# Altium schematic sheet JBC_245.SchDoc
size A4; SheetNumber: 1; SheetTotal: 1
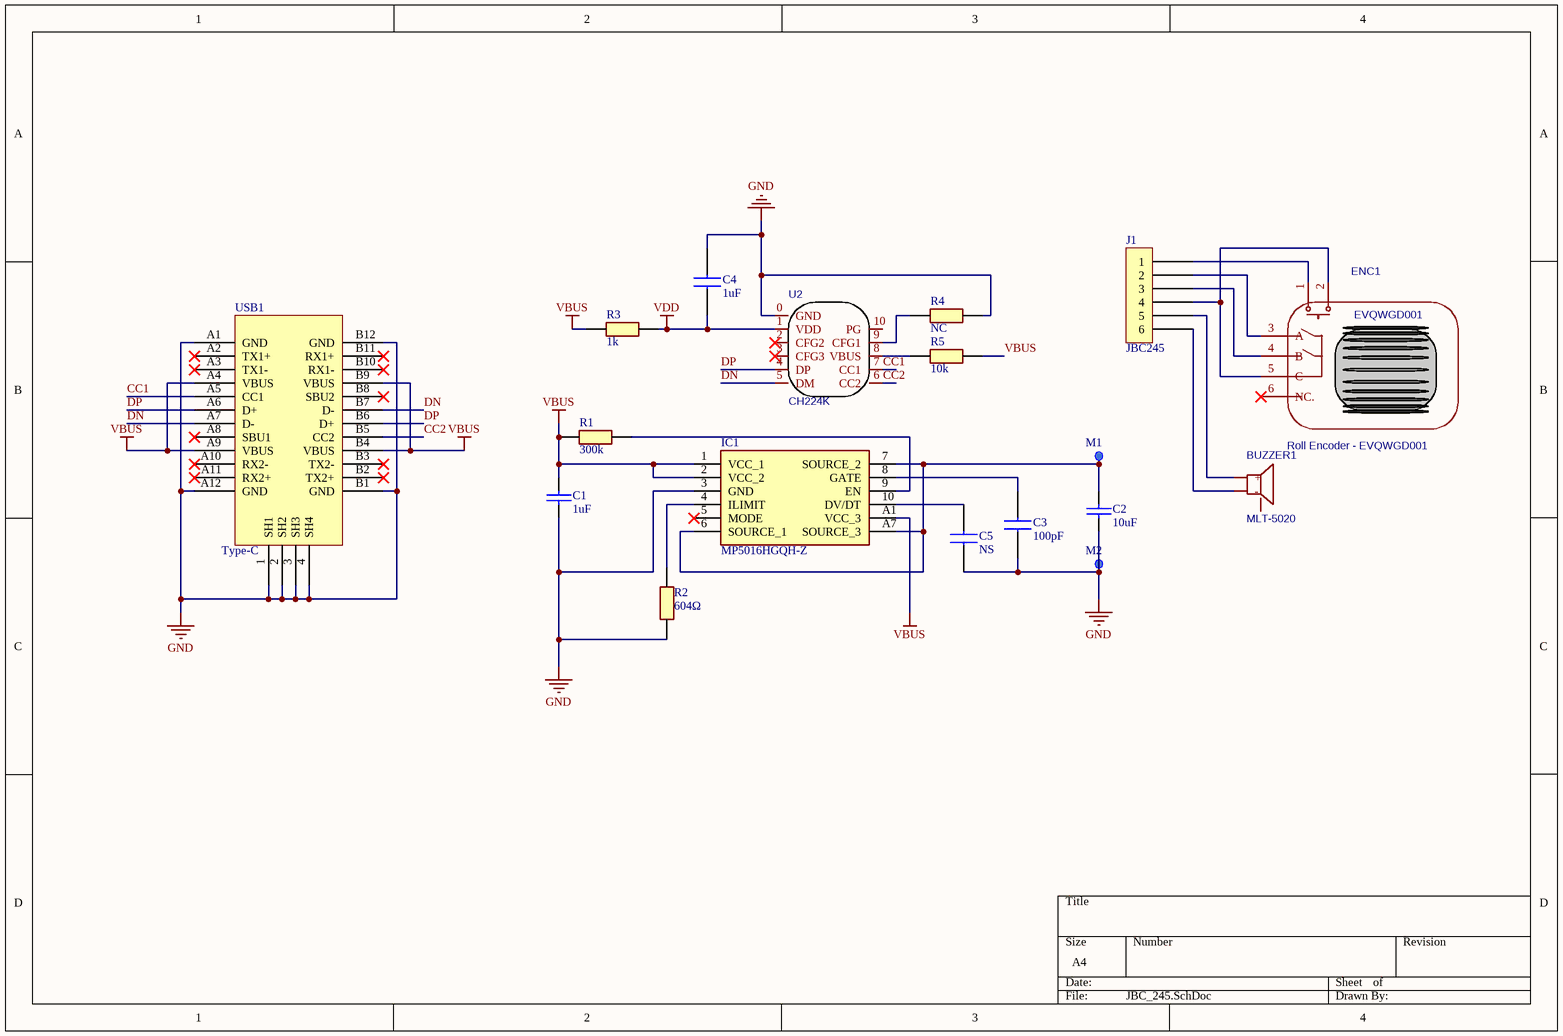
[diagram p0: JBC_245.SchDoc]

## Parts
BUZZER1  MLT-5020  [BUZ-SMD_3P-L5.2-W5.2-P3.50-BR]
C1  1uF  [1206C]
C2  10uF  [1206C]
C3  100pF  [CAP_0402]
C4  1uF  [CAP_0402]
C5  NS  [CAP_0402]
IC1  MP5016HGQH-Z  [MP5016HGQHZ]
J1  JBC245  [JBC_245_Connect]
M1  Test_Point  [TP-PIN]  (value not drawn)
M2  Test_Point  [TP-PIN]  (value not drawn)
R1  300k  [RES_0402]
R2  604Ω  [RES_0402]
R3  1k  [RES_0402]
R4  NC  [RES_0402]
R5  10k  [RES_0402]
U1  Roll Encoder - EVQWGD001  [EVQWGD001 ENCODER]
U2  CH224K  [ESSOP-10_L5.0-W3.9]
USB1  Type-C  [Type-C-TOP]

## Nets
GND: C1.1 C2.1 C3.1 C4.2 C5.1 IC1.3(GND) M2.1 R2.1 R4.2 U2.0(GND) USB1.1(SH1) USB1.2(SH2) USB1.3(SH3) USB1.4(SH4) USB1.A1(GND) USB1.A12(GND) USB1.B1(GND) USB1.B12(GND)
VBUS: C1.2 IC1.1(VCC_1) IC1.2(VCC_2) IC1.A1(VCC_3) R1.1 R3.1 R5.2 USB1.A4(VBUS) USB1.A9(VBUS) USB1.B4(VBUS) USB1.B9(VBUS)
VDD: C4.1 R3.2 U2.1(VDD)
CC1: U2.7(CC1) USB1.A5(CC1)
CC2: U2.6(CC2) USB1.B5(CC2)
DN: U2.5(DM) USB1.A7(D-) USB1.B7(D-)
DP: U2.4(DP) USB1.A6(D+) USB1.B6(D+)
NetBUZZER1_2: BUZZER1.2(+) J1.5
NetBUZZER1_3: BUZZER1.3(-) J1.6
NetC2_2: C2.2 IC1.6(SOURCE_1) IC1.7(SOURCE_2) IC1.A7(SOURCE_3) M1.1
NetC3_2: C3.2 IC1.8(GATE)
NetC5_2: C5.2 IC1.10(DV/DT)
NetIC1_4: IC1.4(ILIMIT) R2.2
NetIC1_9: IC1.9(EN) R1.2
NetJ1_1: J1.1 U1.1(SW1)
NetJ1_2: J1.2 U1.3(A)
NetJ1_3: J1.3 U1.4(B)
NetJ1_4: J1.4 U1.2(SW2) U1.5(C)
NetR4_1: R4.1 U2.9(CFG1)
NetR5_1: R5.1 U2.8(VBUS)

Not connected (* = marked no-connect by the designer): BUZZER1 1(NC); IC1 5(MODE)*; U1 6(NC.)*; U2 2(CFG2)* 3(CFG3)* 10(PG); USB1 A2(TX1+)* A3(TX1-)* A8(SBU1)* A10(RX2-)* A11(RX2+)* B2(TX2+)* B3(TX2-)* B8(SBU2)* B10(RX1-)* B11(RX1+)*

## Notes on the sheet
- (in symbol Roll Encoder - EVQWGD001) ENC1

## Library data of the parts
BUZZER1 = MLT-5020: Buzzer; BOM_Manufacturer: HNDZ; BOM_Supplier: LCSC; BOM_Manufacturer Part: MLT-5020; BOM_Supplier Part: C94598; BOM_JLCPCB Part Class: Extended Part; spicePre: B; spiceSymbolName: MLT-5020
C1 C2 = CAP: 无极性电容
C3-C5 = 0402YC104MAT2A: Capacitor; Manufacturer_Name: AVX; Datasheet Link: http://www.mouser.com/catalog/supplier/library/pdf/AVXSurfaceMountCeramic.pdf; Height: 0.56mm; Manufacturer_Part_Number: 0402YC104MAT2A; Mouser Part Number: 581-0402YC104MAT2A; Mouser Price/Stock: https://www.mouser.co.uk/ProductDetail/AVX/0402YC104MAT2A?qs=O2%2FeDh0sX9yiCaLwpXy1bw%3D%3D
IC1 = MP5016HGQH-Z: Integrated Circuit; Manufacturer_Name: Monolithic Power Systems (MPS); Datasheet Link: https://componentsearchengine.com/Datasheets/1/MP5016HGQH-Z.pdf; Height: 0.9mm; Manufacturer_Part_Number: MP5016HGQH-Z; Mouser Part Number: 946-MP5016HGQH-Z; Mouser Price/Stock: https://www.mouser.co.uk/ProductDetail/Monolithic-Power-Systems-MPS/MP5016HGQH-Z?qs=YCa%2FAAYMW00hGdkGCCsW%252Bw%3D%3D
J1 = JBC_245_Connect
R1-R5 = RC0402JR-1320RL: Resistor; Manufacturer_Name: YAGEO (PHYCOMP); Datasheet Link: http://www.yageo.com/documents/recent/PYu-RC0402_51_RoHS_L_6_r.pdf; Height: 0.4mm; Manufacturer_Part_Number: RC0402JR-1320RL; Mouser Part Number: 603-RC0402JR-1320RL; Mouser Price/Stock: https://www.mouser.co.uk/ProductDetail/YAGEO/RC0402JR-1320RL?qs=qpJ%252B%252B%252Bdg6p3JDOvGKPULsg%3D%3D
U1 = Roll Encoder - EVQWGD001: BOM_Manufacturer: Panasonic; Contributor: ChristAlix; BOM_Manufacturer Part: EVQWGD001; BOM_Supplier: Aliexpress; BOM_Supplier Part: EVQWGD001; spicePre: U; spiceSymbolName: Roll Encoder - EVQWGD001
U2 = CH224K: Contributor: 小茅; spicePre: U; spiceSymbolName: CH224K
USB1 = USB-Type-C-TOP